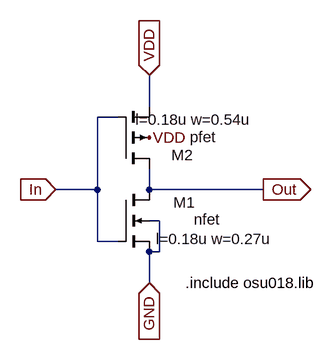
[diagram p0: schematic INV_1.asc]
INV_1.asc, the LTspice schematic file:
Version 4
SHEET 1 1136 680
WIRE 448 -304 448 -352
WIRE 400 -288 368 -288
WIRE 368 -176 368 -288
WIRE 368 -176 304 -176
WIRE 448 -176 448 -208
WIRE 624 -176 448 -176
WIRE 464 -128 448 -128
WIRE 368 -96 368 -176
WIRE 400 -96 368 -96
WIRE 464 -80 464 -128
WIRE 464 -80 448 -80
WIRE 448 -32 448 -80
FLAG 304 -176 In
IOPIN 304 -176 In
FLAG 448 -352 VDD
IOPIN 448 -352 In
FLAG 448 -32 GND
IOPIN 448 -32 In
FLAG 624 -176 Out
IOPIN 624 -176 Out
FLAG 448 -256 VDD
SYMBOL nmos4 400 -176 R0
WINDOW 0 119 20 Right 2
WINDOW 3 157 46 Right 2
WINDOW 123 238 76 Right 2
SYMATTR InstName M1
SYMATTR Value nfet
SYMATTR Value2 l=0.18u w=0.27u
SYMBOL pmos4 400 -208 M180
WINDOW 0 116 21 Right 2
WINDOW 3 151 49 Right 2
WINDOW 123 206 76 Right 2
SYMATTR InstName M2
SYMATTR Value pfet
SYMATTR Value2 l=0.18u w=0.54u
TEXT 504 -32 Left 2 !.include osu018.lib

The netlist it stands for:
* INV_1.asc
M1 Out In GND GND nfet l=0.18u w=0.27u
M2 Out In VDD VDD pfet l=0.18u w=0.54u
.model NMOS NMOS
.model PMOS PMOS
.lib standard.mos
.include osu018.lib
.backanno
.end